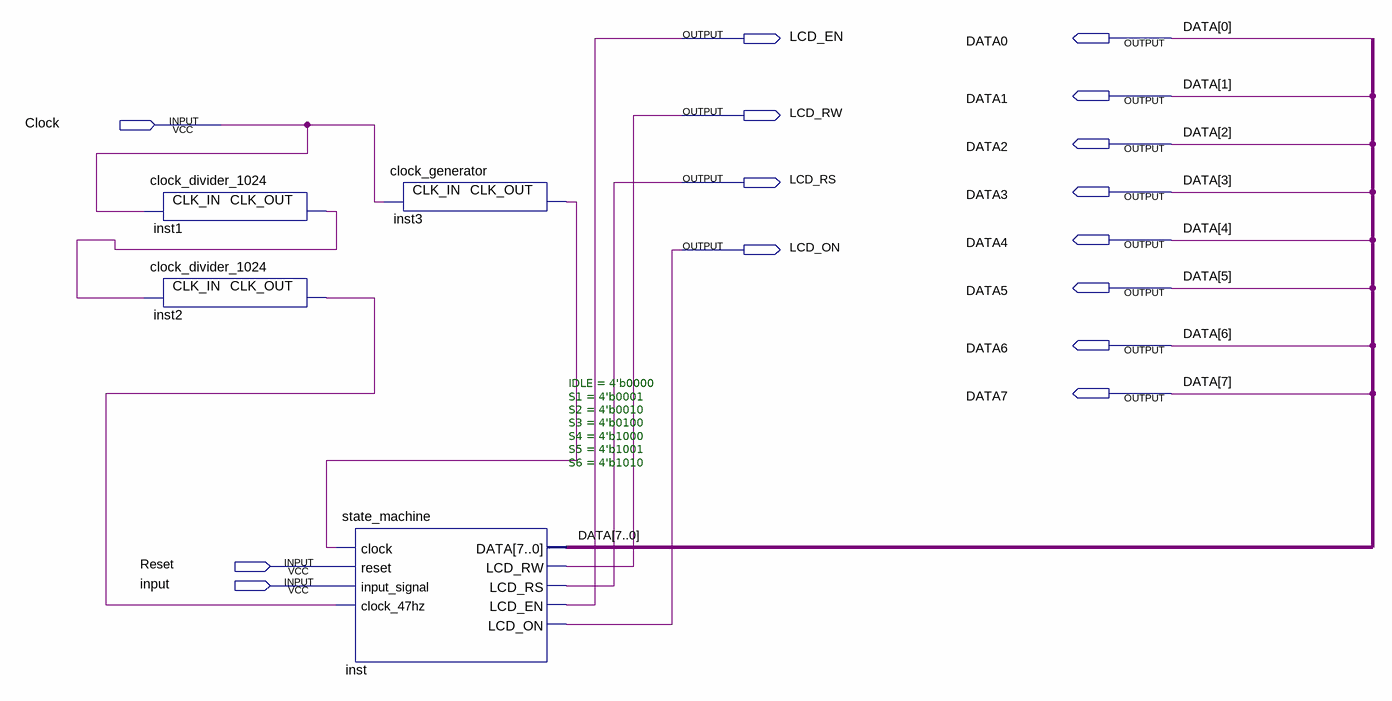
[diagram p0: schematic sheet]
// Quartus schematic lcd.bdf as structural Verilog: 4 symbols, 15 pins
module lcd (
  input  Clock,
  input  Reset,
  input  \input ,
  output LCD_EN,
  output DATA0,
  output DATA1,
  output LCD_RW,
  output DATA2,
  output LCD_RS,
  output DATA3,
  output DATA4,
  output LCD_ON,
  output DATA5,
  output DATA6,
  output DATA7
);

  wire inst1_clk_out, inst2_clk_out, inst3_clk_out;

  clock_divider_1024 inst1 (.CLK_IN(Clock), .CLK_OUT(inst1_clk_out));
  clock_divider_1024 inst2 (.CLK_IN(inst1_clk_out), .CLK_OUT(inst2_clk_out));
  clock_generator inst3 (.CLK_IN(Clock), .CLK_OUT(inst3_clk_out));
  state_machine #(.IDLE(4'b0000), .S1(4'b0001), .S2(4'b0010), .S3(4'b0100), .S4(4'b1000), .S5(4'b1001), .S6(4'b1010)) inst (
    .clock(inst3_clk_out), .reset(Reset), .input_signal(\input ), .clock_47hz(inst2_clk_out),
    .DATA({DATA7, DATA6, DATA5, DATA4, DATA3, DATA2, DATA1, DATA0}), .LCD_RW(LCD_RW), .LCD_RS(LCD_RS),
    .LCD_EN(LCD_EN), .LCD_ON(LCD_ON));
endmodule
